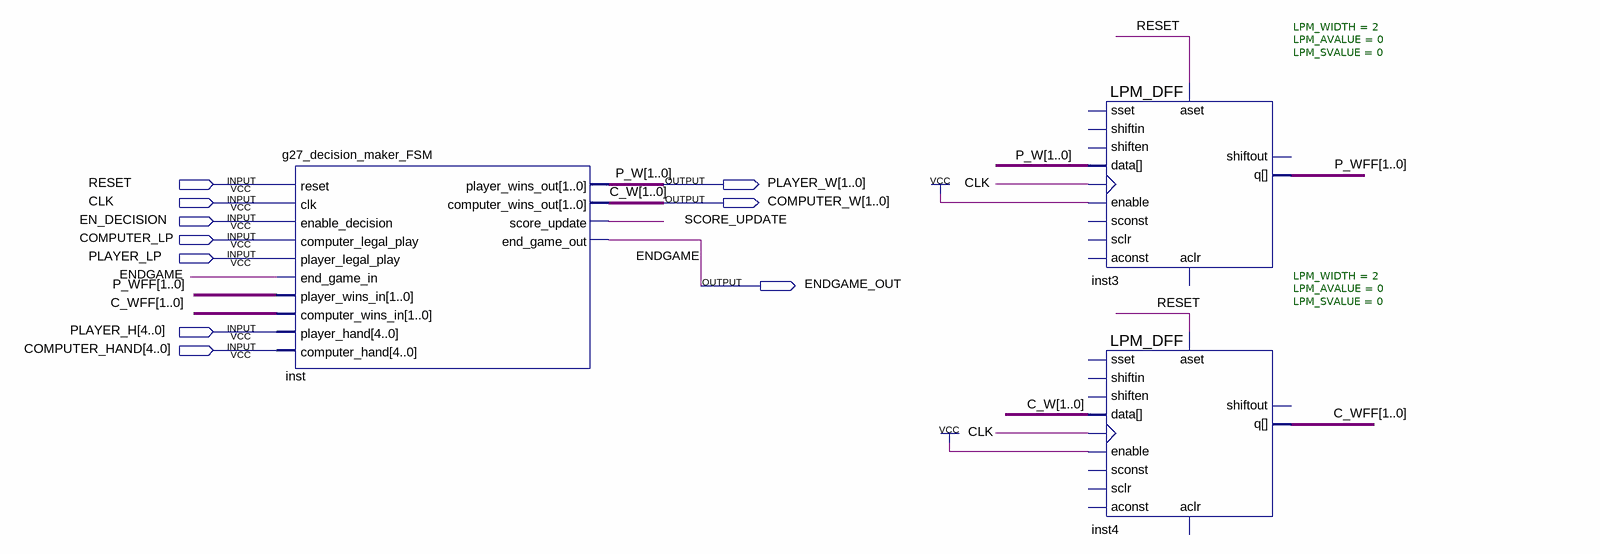
[diagram p0: schematic sheet]
// Quartus schematic g27_decision_maker_FSM_schematic.bdf as structural Verilog: 3 symbols, 10 pins
module g27_decision_maker_FSM_schematic (
  input  RESET,
  input  CLK,
  input  EN_DECISION,
  input  COMPUTER_LP,
  input  PLAYER_LP,
  input  [4:0] PLAYER_H,
  input  [4:0] COMPUTER_HAND,
  output [1:0] PLAYER_W,
  output [1:0] COMPUTER_W,
  output ENDGAME_OUT
);

  wire SCORE_UPDATE;
  wire [1:0] C_WFF, P_WFF;

  g27_decision_maker_FSM inst (
    .reset(RESET), .clk(CLK), .enable_decision(EN_DECISION), .computer_legal_play(COMPUTER_LP),
    .player_legal_play(PLAYER_LP), .end_game_in(ENDGAME_OUT), .player_wins_in(P_WFF),
    .computer_wins_in(C_WFF), .player_hand(PLAYER_H), .computer_hand(COMPUTER_HAND),
    .player_wins_out(PLAYER_W), .computer_wins_out(COMPUTER_W), .score_update(SCORE_UPDATE),
    .end_game_out(ENDGAME_OUT));
  LPM_DFF #(.LPM_WIDTH(2), .LPM_AVALUE(0), .LPM_SVALUE(0)) inst3 (
    .enable(1'b1), .clock(CLK), .data(PLAYER_W), .aset(RESET), .q(P_WFF));  // open: shiftin, shiften, aconst, sclr, sconst, sset, aclr, shiftout
  LPM_DFF #(.LPM_WIDTH(2), .LPM_AVALUE(0), .LPM_SVALUE(0)) inst4 (
    .enable(1'b1), .clock(CLK), .data(COMPUTER_W), .aset(RESET), .q(C_WFF));  // open: shiftin, shiften, aconst, sclr, sconst, sset, aclr, shiftout

  // Other names for the same wires on the sheet: C_W[1:0] = COMPUTER_W; ENDGAME = ENDGAME_OUT; P_W[1:0] = PLAYER_W
endmodule
